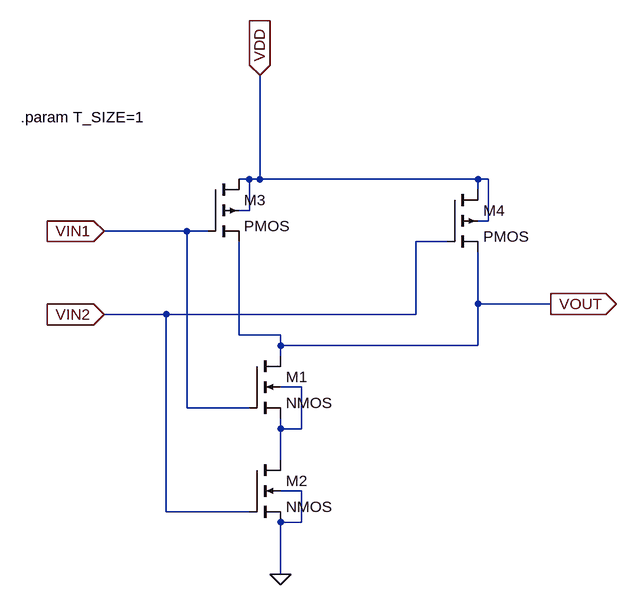
[diagram p0: schematic andnot.asc]
andnot.asc, the LTspice schematic file:
Version 4
SHEET 1 1176 868
WIRE 288 240 272 240
WIRE 304 240 304 80
WIRE 304 240 288 240
WIRE 640 240 304 240
WIRE 656 240 640 240
WIRE 640 256 640 240
WIRE 288 288 288 240
WIRE 288 288 272 288
WIRE 656 304 656 240
WIRE 656 304 640 304
WIRE 192 320 64 320
WIRE 224 320 192 320
WIRE 592 336 544 336
WIRE 640 432 640 352
WIRE 752 432 640 432
WIRE 160 448 64 448
WIRE 544 448 544 336
WIRE 544 448 160 448
WIRE 272 480 272 336
WIRE 336 480 272 480
WIRE 336 496 336 480
WIRE 640 496 640 432
WIRE 640 496 336 496
WIRE 336 512 336 496
WIRE 368 560 336 560
WIRE 192 592 192 320
WIRE 288 592 192 592
WIRE 336 624 336 608
WIRE 368 624 368 560
WIRE 368 624 336 624
WIRE 336 672 336 624
WIRE 368 720 336 720
WIRE 160 752 160 448
WIRE 288 752 160 752
WIRE 368 768 368 720
WIRE 368 768 336 768
WIRE 336 848 336 768
FLAG 64 320 VIN1
IOPIN 64 320 In
FLAG 64 448 VIN2
IOPIN 64 448 In
FLAG 304 80 VDD
IOPIN 304 80 In
FLAG 752 432 VOUT
IOPIN 752 432 Out
FLAG 336 848 0
SYMBOL nmos4 288 512 R0
SYMATTR InstName M1
SYMATTR Value2 l=90n w='{T_SIZE}*200n'
SYMBOL nmos4 288 672 R0
SYMATTR InstName M2
SYMATTR Value2 l=90n w='{T_SIZE}*200n'
SYMBOL pmos4 224 240 R0
SYMATTR InstName M3
SYMATTR Value2 l=90n w='{T_SIZE}*400n'
SYMBOL pmos4 592 256 R0
SYMATTR InstName M4
SYMATTR Value2 l=90n w='{T_SIZE}*400n'
TEXT -64 144 Left 2 !.param T_SIZE=1

The netlist it stands for:
* andnot.asc
M1 VOUT VIN1 N001 N001 NMOS l=90n w='{T_SIZE}*200n'
M2 N001 VIN2 0 0 NMOS l=90n w='{T_SIZE}*200n'
M3 VDD VIN1 VOUT VDD PMOS l=90n w='{T_SIZE}*400n'
M4 VDD VIN2 VOUT VDD PMOS l=90n w='{T_SIZE}*400n'
.model NMOS NMOS
.model PMOS PMOS
.lib standard.mos
.param T_SIZE=1
.backanno
.end